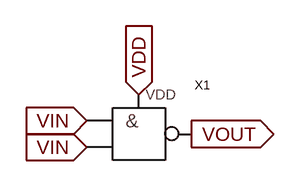
[diagram p0: schematic inverter_2.asc]
inverter_2.asc, the LTspice schematic file:
Version 4
SHEET 1 880 680
FLAG 16 48 VIN
IOPIN 16 48 In
FLAG 16 80 VIN
IOPIN 16 80 In
FLAG 80 16 VDD
IOPIN 80 16 In
FLAG 144 64 VOUT
IOPIN 144 64 Out
SYMBOL nand_2 80 64 R0
SYMATTR InstName X1

The netlist it stands for:
* inverter_2.asc
XX1 VIN VIN VDD VOUT nand_2  ; pins VIN1 VIN2 VDD VOUT
.backanno
.end